# EAGLE design SonarBoardV3 (EAGLE 9.5.1)
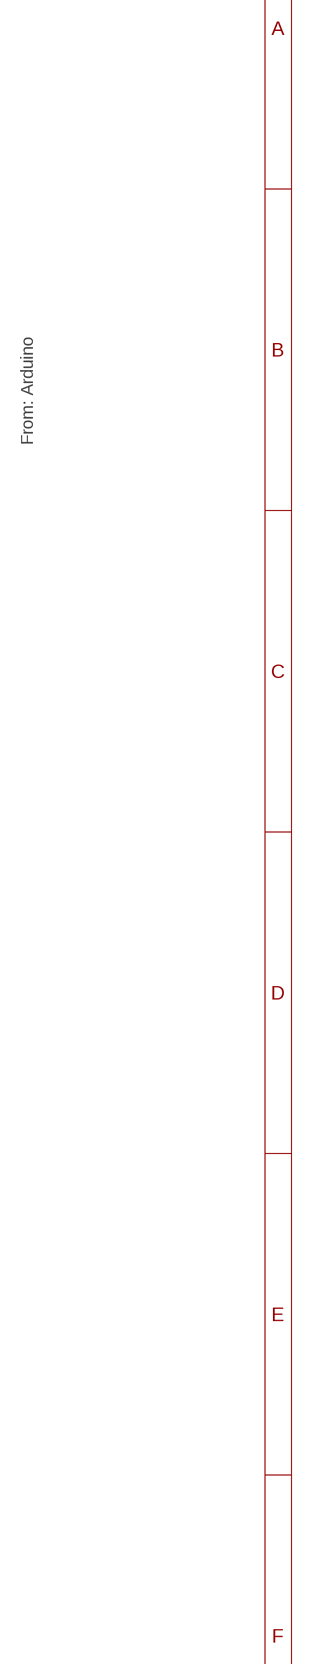
[diagram p0: schematic, sheet 1, part 1 of 2]
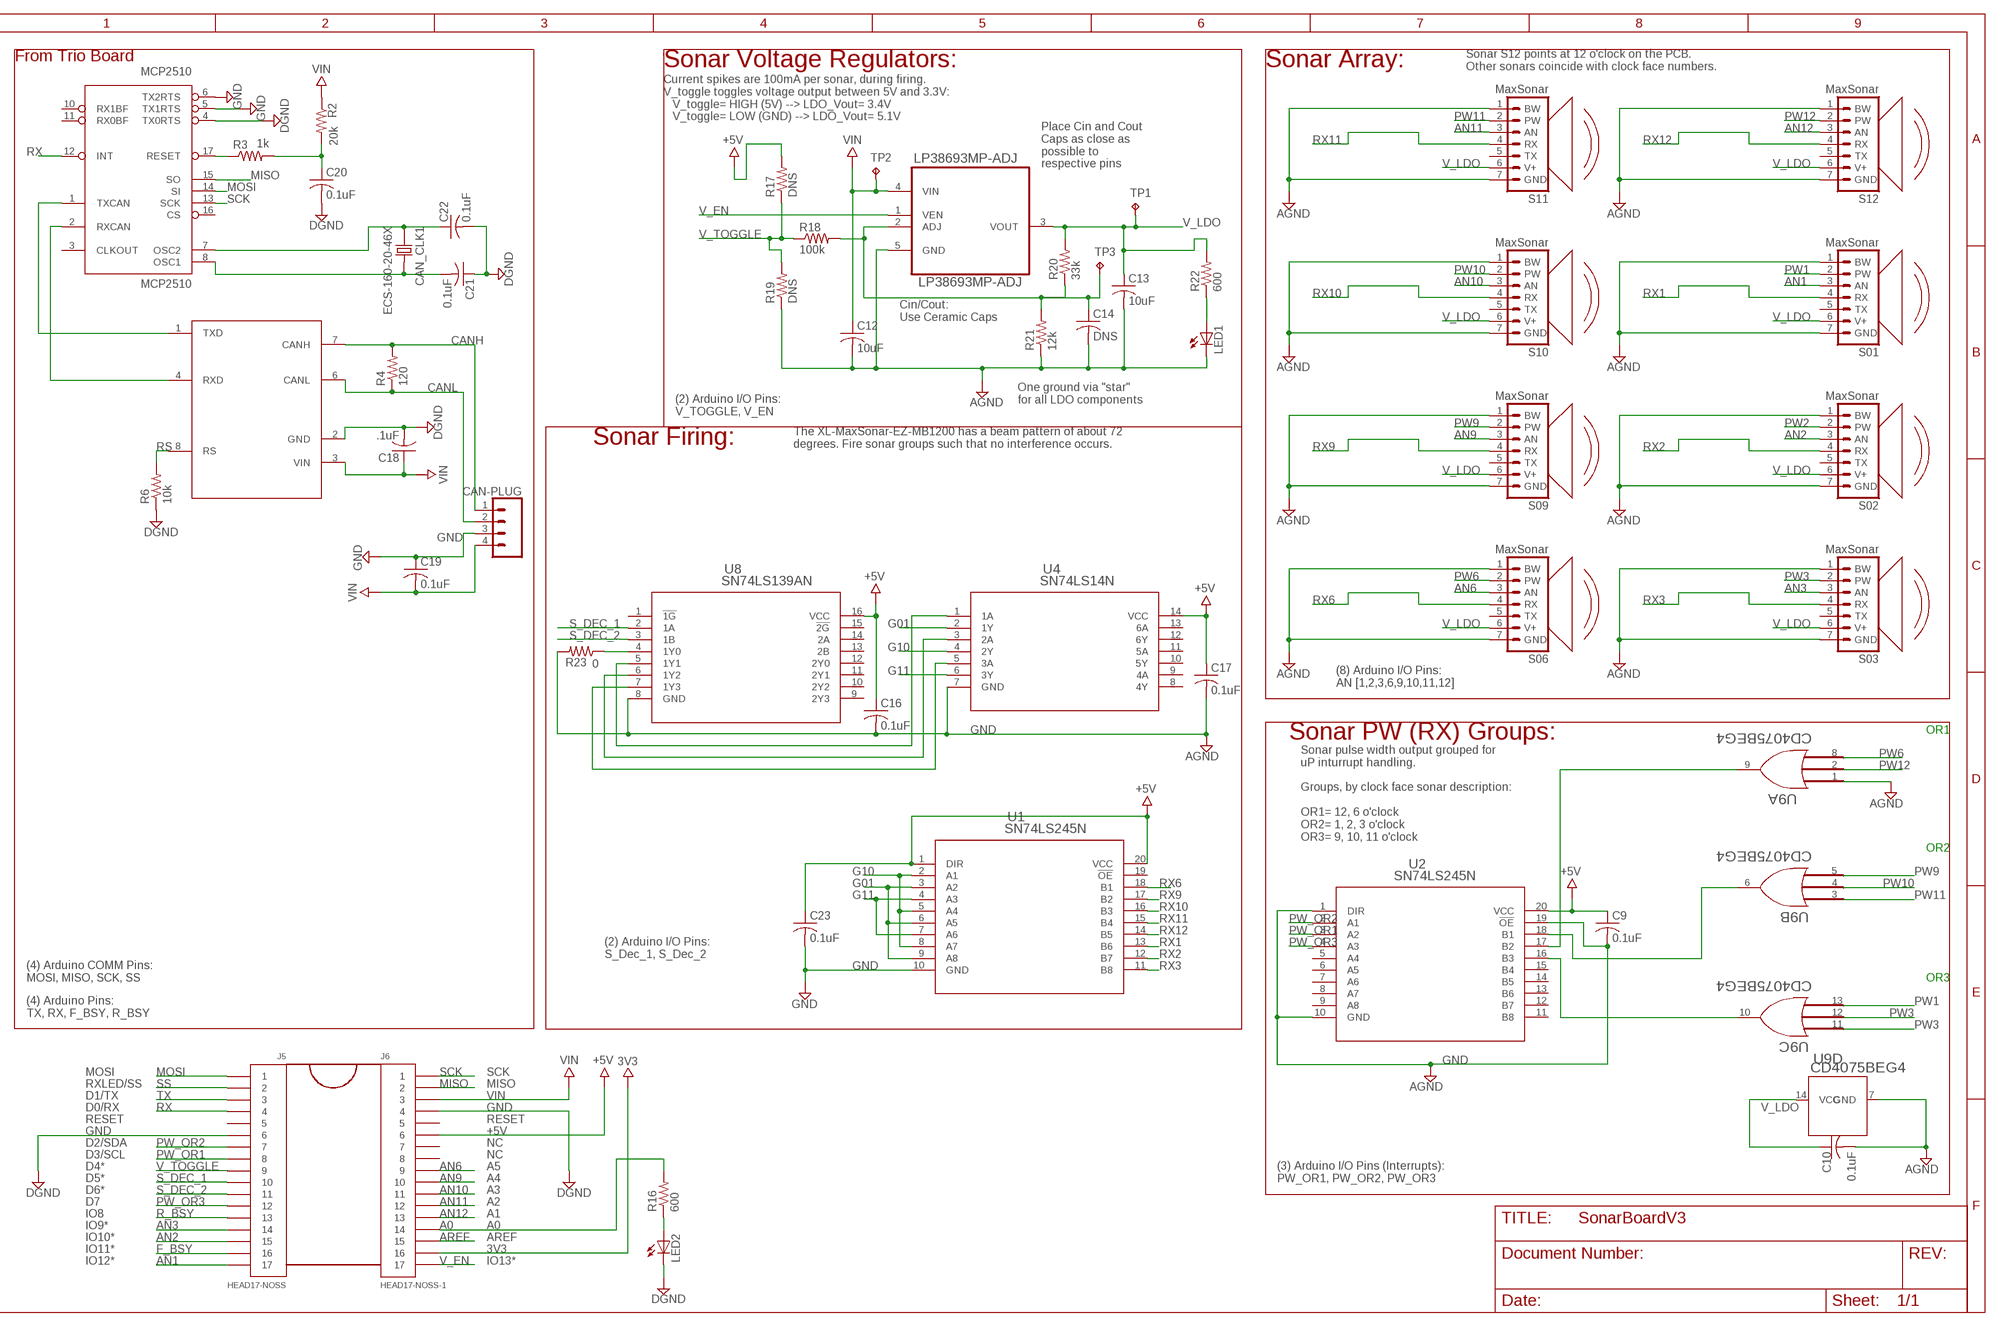
[diagram p1: schematic, sheet 1, part 2 of 2]

## Parts
C9  0.1uF  C-US025-024X044  [C025-024X044]
C10  0.1uF  C-US025-024X044  [C025-024X044]
C12  10uF  C-US025-024X044  [C025-024X044]
C13  10uF  C-US025-024X044  [C025-024X044]
C14  DNS  C-US025-024X044  [C025-024X044]
C16  0.1uF  C-US025-024X044  [C025-024X044]
C17  0.1uF  C-US025-024X044  [C025-024X044]
C18  .1uF  C-US025-024X044  [C025-024X044]
C19  0.1uF  C-US025-024X044  [C025-024X044]
C20  0.1uF  C-US025-024X044  [C025-024X044]
C21  0.1uF  C-US025-024X044  [C025-024X044]
C22  0.1uF  C-US025-024X044  [C025-024X044]
C23  0.1uF  C-US025-024X044  [C025-024X044]
CAN_CLK1  ECS-160-20-46X  [XTAL_ECS-160-20-46X]
J2  CAN-PLUG  CONN_04SCREW  [SCREWTERMINAL-3.5MM-4]
J5  HEAD17-NOSS  [HEAD17-NOSS]
J6  HEAD17-NOSS-1  [HEAD17-NOSS-1]
LED1  LED3MM  [LED3MM]
LED2  LED3MM  [LED3MM]
LP38693MP-ADJ  LP38693MP-ADJ  [SOT150P696X180-5N]
MCP2510  MCP2510  MCP2510P  [DIL18]
MCP2551  MCP2551  MCP2551MCP2551  [DIL08]
R2  20k  R-US_0207/9  [0207/9]
R3  1k  R-US_0207/9  [0207/9]
R4  120  R-US_0207/9  [0207/9]
R6  10k  R-US_0207/9  [0207/9]
R16  600  R-US_0207/9  [0207/9]
R17  DNS  R-US_0207/9  [0207/9]
R18  100k  R-US_0207/9  [0207/9]
R19  DNS  R-US_0207/9  [0207/9]
R20  33k  R-US_0207/9  [0207/9]
R21  12k  R-US_0207/9  [0207/9]
R22  600  R-US_0207/9  [0207/9]
R23  0  R-US_0207/9  [0207/9]
S01  MaxSonar  XL-MAXSONAR-EDGE_MOUNT  [XL-MAXSONAR-PACKAGE]
S02  MaxSonar  XL-MAXSONAR-EDGE_MOUNT  [XL-MAXSONAR-PACKAGE]
S03  MaxSonar  XL-MAXSONAR-EDGE_MOUNT  [XL-MAXSONAR-PACKAGE]
S06  MaxSonar  XL-MAXSONAR-EDGE_MOUNT  [XL-MAXSONAR-PACKAGE]
S09  MaxSonar  XL-MAXSONAR-EDGE_MOUNT  [XL-MAXSONAR-PACKAGE]
S10  MaxSonar  XL-MAXSONAR-EDGE_MOUNT  [XL-MAXSONAR-PACKAGE]
S11  MaxSonar  XL-MAXSONAR-EDGE_MOUNT  [XL-MAXSONAR-PACKAGE]
S12  MaxSonar  XL-MAXSONAR-EDGE_MOUNT  [XL-MAXSONAR-PACKAGE]
TP1  TPPAD1-17  [P1-17]
TP2  TPPAD1-17  [P1-17]
TP3  TPPAD1-17  [P1-17]
U1  SN74LS245N  [N20]
U2  SN74LS245N  [N20]
U4  SN74LS14N  [N14]
U8  SN74LS139AN  [N16]
U9  CD4075BEG4  [N14]

## Nets
3V3: J6.16
+5V: C9.1 C16.1 C17.1 C23.1 J6.6 R17.2 U1.1(DIR) U1.20(VCC) U2.20(VCC) U4.14(VCC) U8.16(VCC)
A0: J6.14 R16.2
AN1: J5.17 S01.3(AN)
AN2: J5.15 S02.3(AN)
AN3: J5.14 S03.3(AN)
AN6: J6.9 S06.3(AN)
AN9: J6.10 S09.3(AN)
AN10: J6.11 S10.3(AN)
AN11: J6.12 S11.3(AN)
AN12: J6.13 S12.3(AN)
AREF: J6.15
CANH: J2.1 MCP2551.7(CANH) R4.2
CANL: J2.2 MCP2551.6(CANL) R4.1
F_BSY: J5.16
G01: U1.3(A2) U1.6(A5) U1.9(A8) U4.2(1Y)
G10: U1.2(A1) U1.5(A4) U1.8(A7) U4.4(2Y)
G11: U1.4(A3) U1.7(A6) U4.6(3Y)
GND: C9.2 C10.2 C12.2 C13.2 C14.2 C16.2 C17.2 C18.2 C19.1 C20.2 C21.1 C22.2 C23.2 J2.3 J5.6 J6.4 LED1.K(C) LED2.K(C) LP38693MP-ADJ.5(GND) MCP2510.4(TX0RTS) MCP2510.5(TX1RTS) MCP2510.6(TX2RTS) MCP2551.2(GND) R6.1 R19.1 R21.1 R23.2 S01.1(BW) S01.7(GND) S02.1(BW) S02.7(GND) S03.1(BW) S03.7(GND) S06.1(BW) S06.7(GND) S09.1(BW) S09.7(GND) S10.1(BW) S10.7(GND) S11.1(BW) S11.7(GND) S12.1(BW) S12.7(GND) U1.10(GND) U2.1(DIR) U2.10(GND) U2.19(!OE) U4.7(GND) U8.8(GND) U9.7(D:GND) ; supply symbol labelled AGND, DGND
MISO: J6.2 MCP2510.15(SO)
MOSI: J5.1 MCP2510.14(SI)
N$1: U4.5(3A) U8.7(1Y3)
N$2: LED2.A R16.1
N$3: U2.16(B3) U9.10(C:J)
N$4: C21.2 CAN_CLK1.2 MCP2510.8(OSC1)
N$5: U4.3(2A) U8.6(1Y2)
N$14: LED1.A R22.1
N$21: U4.1(1A) U8.5(1Y1)
N$22: C22.1 CAN_CLK1.1 MCP2510.7(OSC2)
N$24: MCP2510.2(RXCAN) MCP2551.4(RXD)
N$25: MCP2510.1(TXCAN) MCP2551.1(TXD)
N$26: MCP2510.17(RESET) R3.1
N$27: C20.1 R2.2 R3.2
N$30: R23.1 U8.4(1Y0)
N$43: U2.17(B2) U9.9(A:J)
N$44: U2.18(B1) U9.6(B:J)
PW1: S01.2(PW)
PW2: S02.2(PW)
PW3: S03.2(PW)
PW6: S06.2(PW) ; supply symbol labelled AGND
PW9: S09.2(PW)
PW10: S10.2(PW)
PW11: S11.2(PW)
PW12: S12.2(PW)
PW_OR1: J5.8 U2.3(A2)
PW_OR2: J5.7 U2.2(A1)
PW_OR3: J5.12 U2.4(A3)
R_BSY: J5.13
RS: MCP2551.8(RS) R6.2
RX: J5.4 MCP2510.12(INT)
RX1: S01.4(RX) U1.13(B6)
RX2: S02.4(RX) U1.12(B7)
RX3: S03.4(RX) U1.11(B8)
RX6: S06.4(RX) U1.18(B1)
RX9: S09.4(RX) U1.17(B2)
RX10: S10.4(RX) U1.16(B3)
RX11: S11.4(RX) U1.15(B4)
RX12: S12.4(RX) U1.14(B5)
S_DEC_1: J5.10 U8.2(1A)
S_DEC_2: J5.11 U8.3(1B)
SCK: J6.1 MCP2510.13(SCK)
SS: J5.2
TX: J5.3
V_ADJ: C14.1 LP38693MP-ADJ.2(ADJ) R18.2 R20.1 R21.2 TP3.TP
V_EN: J6.17 LP38693MP-ADJ.1(VEN)
V_LDO: C10.1 C13.1 LP38693MP-ADJ.3(VOUT) R20.2 R22.2 S01.6(V+) S02.6(V+) S03.6(V+) S06.6(V+) S09.6(V+) S10.6(V+) S11.6(V+) S12.6(V+) TP1.TP U9.14(D:VCC)
V_TOGGLE: J5.9 R17.1 R18.1 R19.2
VIN: C12.1 C18.1 C19.2 J2.4 J6.3 LP38693MP-ADJ.4(VIN) MCP2551.3(VIN) R2.1 TP2.TP
Unconnected: J5.5 J6.5 J6.7 J6.8 MCP2510.3(CLKOUT) MCP2510.9(VSS) MCP2510.10(RX1BF) MCP2510.11(RX0BF) MCP2510.16(CS) MCP2510.18(VDD) S01.5(TX) S02.5(TX) S03.5(TX) S06.5(TX) S09.5(TX) S10.5(TX) S11.5(TX) S12.5(TX) U1.19(!OE) U2.5(A4) U2.6(A5) U2.7(A6) U2.8(A7) U2.9(A8) U2.11(B8) U2.12(B7) U2.13(B6) U2.14(B5) U2.15(B4) U4.8(4Y) U4.9(4A) U4.10(5Y) U4.11(5A) U4.12(6Y) U4.13(6A) U8.1(!1G) U8.9(2Y3) U8.10(2Y2) U8.11(2Y1) U8.12(2Y0) U8.13(2B) U8.14(2A) U8.15(!2G) U9.1(A:A) U9.2(A:B) U9.3(B:A) U9.4(B:B) U9.5(B:C) U9.8(A:C) U9.11(C:A) U9.12(C:B) U9.13(C:C)

## Notes on the sheet
- From Trio Board | Sonar Voltage Regulators: | Sonar Array:
- Sonar S12 points at 12 o'clock on the PCB.
  Other sonars coincide with clock face numbers.
- Current spikes are 100mA per sonar, during firing.
  V_toggle toggles voltage output between 5V and 3.3V:
     V_toggle= HIGH (5V) --> LDO_Vout= 3.4V
     V_toggle= LOW (GND) --> LDO_Vout= 5.1V
- Place Cin and Cout 
  Caps as close as 
  possible to 
  respective pins
- Cin/Cout:
  Use Ceramic Caps
- One ground via "star"
  for all LDO components
- From: Arduino
- (2) Arduino I/O Pins:
  V_TOGGLE, V_EN
- Sonar Firing:
- The XL-MaxSonar-EZ-MB1200 has a beam pattern of about 72
  degrees. Fire sonar groups such that no interference occurs.
- (8) Arduino I/O Pins: 
  AN [1,2,3,6,9,10,11,12]
- Sonar PW (RX) Groups:
- OR1
- Sonar pulse width output grouped for 
  uP inturrupt handling.  
  
  Groups, by clock face sonar description:
  
  OR1= 12, 6 o'clock
  OR2= 1, 2, 3 o'clock
  OR3= 9, 10, 11 o'clock
- OR2
- (2) Arduino I/O Pins: 
  S_Dec_1, S_Dec_2
- (4) Arduino COMM Pins:
  MOSI, MISO, SCK, SS
- OR3
- (4) Arduino Pins: 
  TX, RX, F_BSY, R_BSY
- MOSI | SCK
- RXLED/SS | MISO
- D1/TX | VIN
- D0/RX | GND
- RESET | RESET
- GND | +5V
- D2/SDA | NC
- D3/SCL | NC
- D4* | A5
- D5* | A4
- (3) Arduino I/O Pins (Interrupts): 
  PW_OR1, PW_OR2, PW_OR3
- D6* | A3
- D7 | A2
- IO8 | A1
- IO9* | A0
- IO10* | AREF
- IO11* | 3V3
- IO12* | IO13*

## Library data of the parts
C9 C10 C12-C14 C16 C17 C23 = adafruit:C-US: CAPACITOR, American symbol
C18-C22 = rcl:C-US: CAPACITOR, American symbol; SPICEPREFIX: C
CAN_CLK1 = ECS-160-20-46X:ECS-160-20-46X: QUARTZ CRYSTAL T/H; DESCRIPTION: Crystal 16MHz ±30ppm _Tol_ ±50ppm _Stability_ 20pF FUND 50Ohm; DIGI-KEY_PART_NUMBER: XC1759-ND; DIGI-KEY_PURCHASE_URL: https://www.digikey.com/product-detail/en/ecs-inc/ECS-160-20-46X/XC1759-ND/2676589?utm_source=snapeda&utm_medium=aggregator&utm_campaign=symbol; MF: ECS Inc.; MP: ECS-160-20-46X; PACKAGE: HC46/X ECS International
J2 = SparkFun-Connectors:CONN_04: Multi connection point. Often used as Generic Header-pin footprint for 0.1 inch spaced/style header connections On any of the 0.1 inch spaced packages, you can populate with these: Break Away Headers - Straight <https://www.sparkfun.com/products/116> (PRT-00116) Break Away Male Headers - Right Angle <https://www.sparkfun.com/products/553> (PRT-00553) Female Headers <https://www.sparkfun.com/products/115> (PRT-00115) Break Away Headers - Machine Pin <https://www.sparkfun.com/products/117> (PRT-00117) Break Away Female Headers - Swiss Machine Pin <https://www.sparkfun.com/products/743> (PRT-00743) For SCREWTERMINALS and SPRING TERMINALS visit here: Screw Terimnals on SparkFun.com <https://www.sparkfun.com/search/results?term=Screw+Terminals> (5mm/3.5mm/2.54mm spacing) This device is also useful as a general connection point to wire up your design to another part of your project. Our various solder wires solder well into these plated through hole pads. Hook-Up Wire - Assortment (Stranded, 22 AWG) <https://www.sparkfun.com/products/11375> (PRT-11375) Hook-Up Wire - Assortment (Solid Core, 22 AWG) <https://www.sparkfun.com/products/11367> (PRT-11367) View the entire wire category on our website here <https://www.sparkfun.com/categories/141> Special notes: Molex polarized connector foot print use with SKU : PRT-08231 with associated crimp pins and housings. 1MM SMD Version SKU: PRT-10208; PROD_ID: CONN-14485
J5 = SmartPrj:HEAD17-NOSS
J6 = SmartPrj:HEAD17-NOSS-1
LED1 LED2 = adafruit:LED: LED OSRAM: - CHIPLED LG R971, LG N971, LY N971, LG Q971, LY Q971, LO R971, LY R971 LH N974, LH R974 LS Q976, LO Q976, LY Q976 LO Q996 - Hyper CHIPLED LW Q18S LB Q993, LB Q99A, LB R99A - SideLED LS A670, LO A670, LY A670, LG A670, LP A670 LB A673, LV A673, LT A673, LW A673 LH A674 LY A675 LS A676, LA A676, LO A676, LY A676, LW A676 LS A679, LY A679, LG A679 - Hyper Micro SIDELED® LS Y876, LA Y876, LO Y876, LY Y876 LT Y87S - SmartLED LW L88C, LW L88S LB L89C, LB L89S, LG L890 LS L89K, LO L89K, LY L89K LS L896, LA L896, LO L896, LY L896 - TOPLED LS T670, LO T670, LY T670, LG T670, LP T670 LSG T670, LSP T670, LSY T670, LOP T670, LYG T670 LG T671, LOG T671, LSG T671 LB T673, LV T673, LT T673, LW T673 LH T674 LS T676, LA T676, LO T676, LY T676, LB T676, LH T676, LSB T676, LW T676 LB T67C, LV T67C, LT T67C, LS T67K, LO T67K, LY T67K, LW E67C LS E67B, LA E67B, LO E67B, LY E67B, LB E67C, LV E67C, LT E67C LW T67C LS T679, LY T679, LG T679 LS T770, LO T770, LY T770, LG T770, LP T770 LB T773, LV T773, LT T773, LW T773 LH T774 LS E675, LA E675, LY E675, LS T675 LS T776, LA T776, LO T776, LY T776, LB T776 LHGB T686 LT T68C, LB T68C - Hyper Mini TOPLED® LB M676 - Mini TOPLED Santana® LG M470 LS M47K, LO M47K, LY M47K Source: http://www.osram.convergy.de/
LP38693MP-ADJ = ElcanoProject:LP38693MP-ADJ: IC, ADJ LDO REG, 1.25V TO 9V; MPN: LP38693MP-ADJ; OC_FARNELL: 1685718; OC_NEWARK: 41K7493; PACKAGE: SOT-223-5; SUPPLIER: NationalSemiconductor
MCP2510 = microchip_can:MCP2510
MCP2551 = MCP2551:MCP2551
R2-R4 R6 R16-R23 = adafruit:R-US_: RESISTOR, American symbol
S01-S03 S06 S09 S10-S12 = ElcanoProject:XL-MAXSONAR
TP1-TP3 = testpad:TP: Test pad
U1 U2 = SN74LS245:SN74LS245N; MANUFACTURER_PART_NUMBER: SN74LS245N; VENDOR: Texas Instruments
U4 = SN74LS14:SN74LS14N; MANUFACTURER_PART_NUMBER: SN74LS14N; VENDOR: Texas Instruments
U8 = SN74LS139AN:SN74LS139AN; MANUFACTURER_PART_NUMBER: SN74LS139AN; VENDOR: Texas Instruments
U9 = CD4075BE:CD4075BEG4; MANUFACTURER_PART_NUMBER: CD4075BEG4; VENDOR: Texas Instruments

## Net classes
0 default: width 0.254 mm, drill 0.508 mm, clearance 0.203 mm

## Board
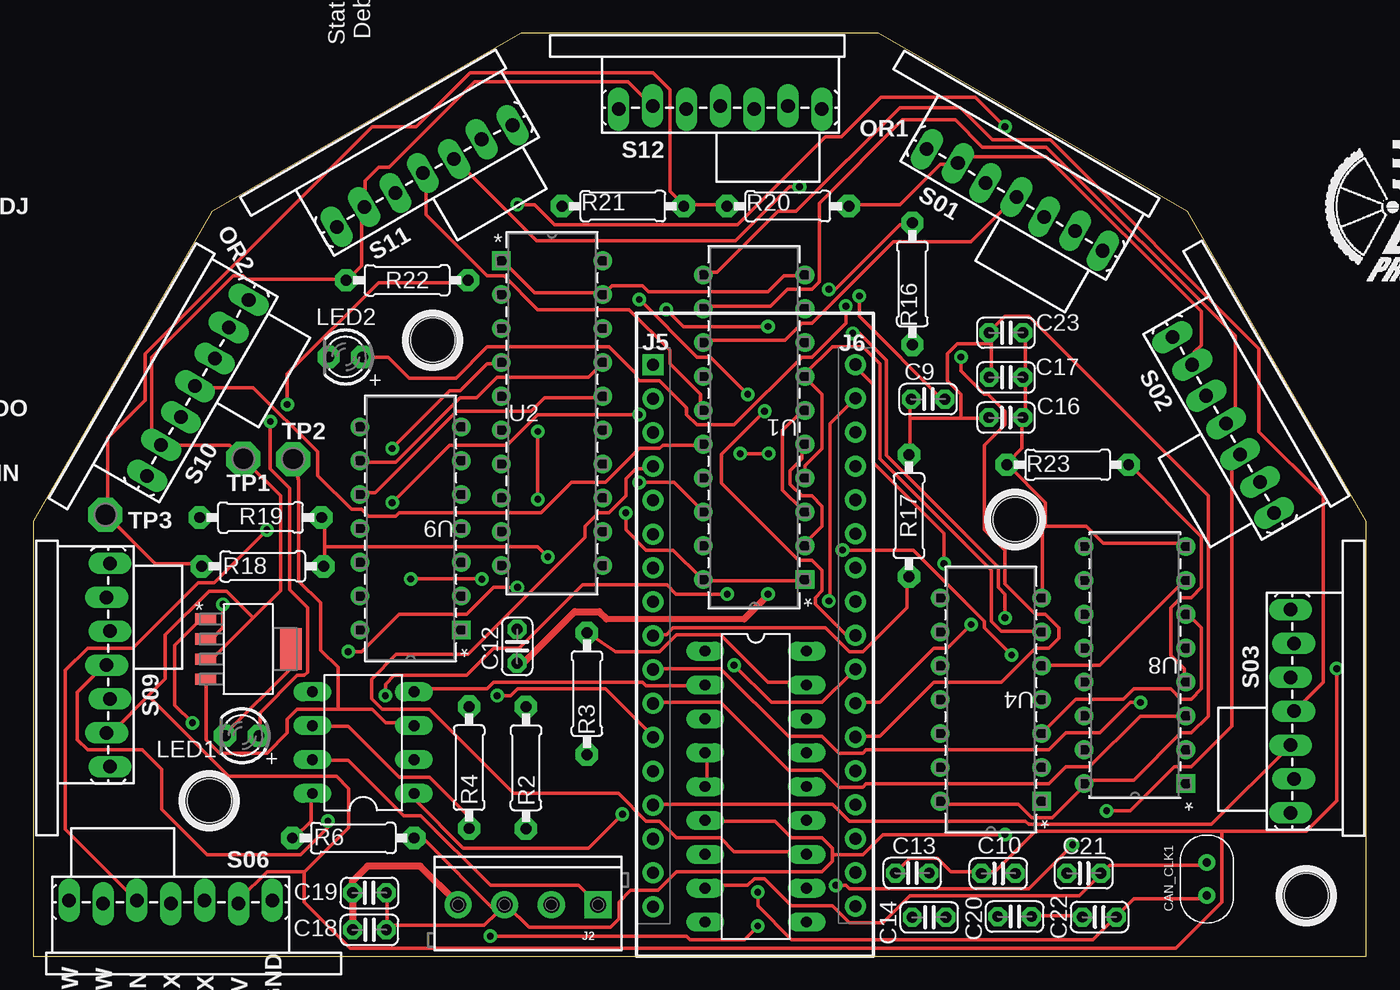
[diagram p2: board, top side]
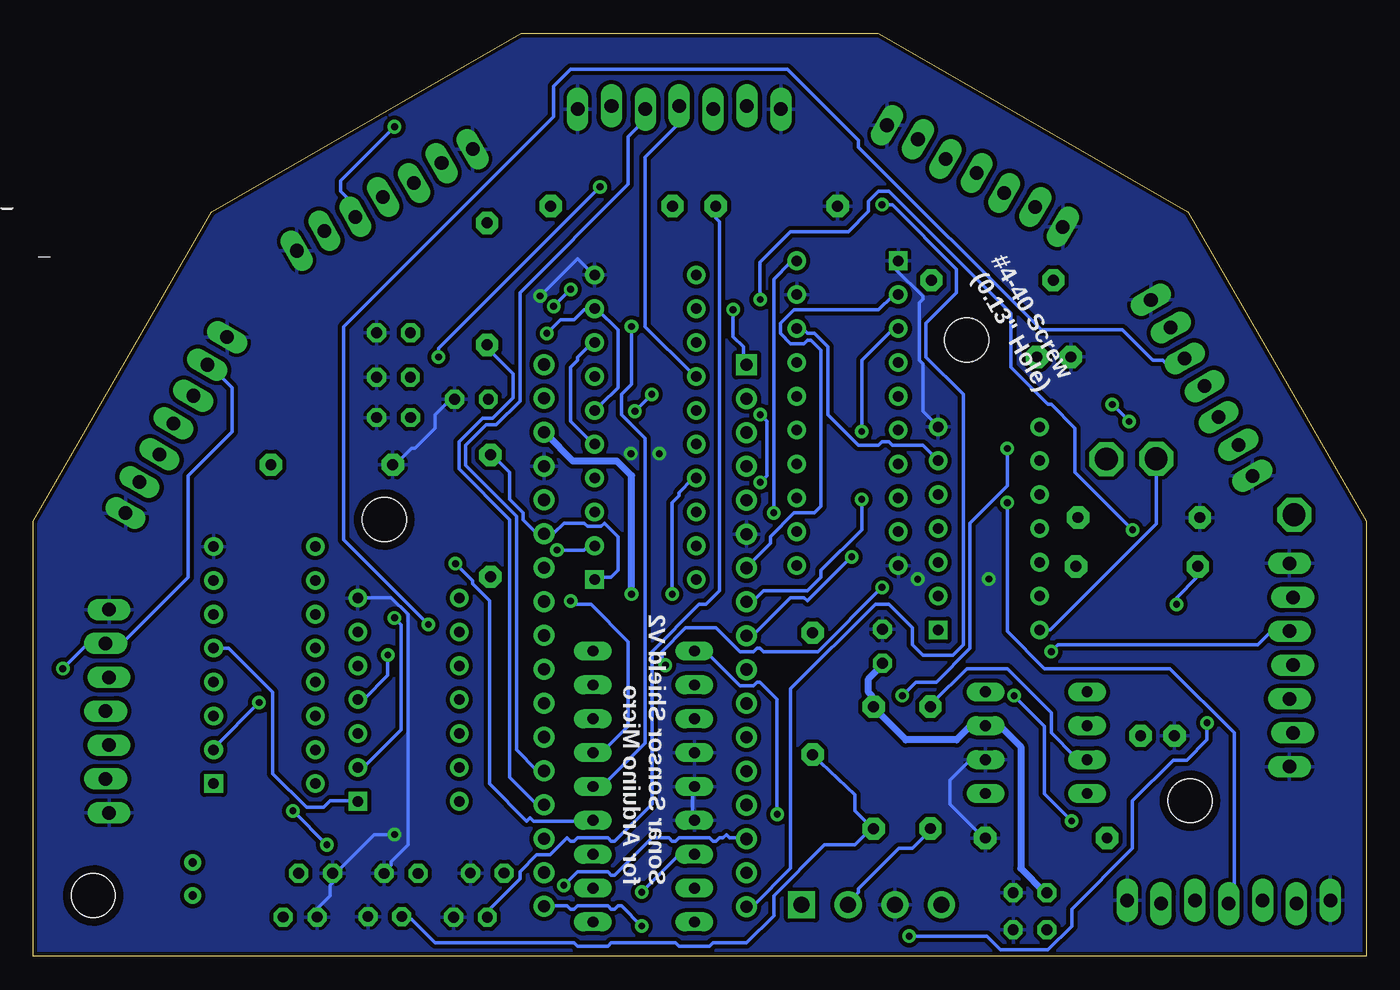
[diagram p3: board, bottom side, seen from below]

Size 100 x 69.24 mm. Coordinates in mm from the lower left corner, seen from the top.
Outline: 0,0 100,0 100,32.63 86.6,55.84 63.4,69.24 36.6,69.24 13.4,55.84 0,32.63 0,0
Copper layers (1*16): Top 0.035mm / dielectric 1.5mm / Bottom 0.035mm
Design rules "SparkFun *": minimum track width 8mil, minimum drill 20mil, track to track 10mil, track to pad 10mil, pad to pad 8mil, via to via 8mil, smd to smd 8mil, copper to edge 10mil, drill to drill 8mil, minimum pad ring 12mil, minimum via ring 10mil, stop-mask expansion 4mil, vias tented up to drill 25mil, thermal gap 10mil

### Footprints (pad centres in the part's own frame; a part is rotated, then mirrored left to right if it is on the bottom)
C025-024X044 = drill 0.813 pad 1.422 octagon: 1 -1.27,0; 2 1.27,0
C025-024X044' = drill 0.813 octagon: 1 -1.27,0; 2 1.27,0
XTAL_ECS-160-20-46X = drill 0.63 pad 1.03: 1 -1.25,0; 2 1.25,0
SCREWTERMINAL-3.5MM-4 = drill 1.2 pad 2.032 square: 1 0,0 | drill 1.2 pad 2.032: 2 3.5,0; 3 7,0; 4 10.5,0
HEAD17-NOSS = drill 0.914 pad 1.575 square: 1 0,0 | drill 0.914 pad 1.575: 2 2.54,0; 3 5.08,0; 4 7.62,0; 5 10.16,0; 6 12.7,0; 7 15.24,0; 8 17.78,0; 9 20.32,0; 10 22.86,0; 11 25.4,0; 12 27.94,0; 13 30.48,0; 14 33.02,0; 15 35.56,0; 16 38.1,0; 17 40.64,0
HEAD17-NOSS-1 = drill 0.914 pad 1.575: 1 0,0; 2 2.54,0; 3 5.08,0; 4 7.62,0; 5 10.16,0; 6 12.7,0; 7 15.24,0; 8 17.78,0; 9 20.32,0; 10 22.86,0; 11 25.4,0; 12 27.94,0; 13 30.48,0; 14 33.02,0; 15 35.56,0; 16 38.1,0; 17 40.64,0
LED3MM = drill 0.813 pad 1.676 octagon: A -1.27,0; K 1.27,0
SOT150P696X180-5N = smd 1.6 x 0.838: 1 -3.2,2.261; 2 -3.2,0.762; 3 -3.2,-0.762; 4 -3.2,-2.261 | smd 1.6 x 3.099: 5 3.2,0
DIL18 = drill 0.813 long: 1 -10.16,-3.81; 2 -7.62,-3.81; 3 -5.08,-3.81; 4 -2.54,-3.81; 5 0,-3.81; 6 2.54,-3.81; 7 5.08,-3.81; 8 7.62,-3.81; 9 10.16,-3.81; 10 10.16,3.81; 11 7.62,3.81; 12 5.08,3.81; 13 2.54,3.81; 14 0,3.81; 15 -2.54,3.81; 16 -5.08,3.81; 17 -7.62,3.81; 18 -10.16,3.81
DIL08 = drill 0.813 long: 1 -3.81,-3.81; 2 -1.27,-3.81; 3 1.27,-3.81; 4 3.81,-3.81; 5 3.81,3.81; 6 1.27,3.81; 7 -1.27,3.81; 8 -3.81,3.81
0207/9 = drill 0.813 pad 1.676 octagon: 1 -4.572,0; 2 4.572,0
XL-MAXSONAR-PACKAGE = drill 1.016 long: 1 -9.16,0.167; 2 -6.62,-0.087; 3 -4.08,0.167; 4 -1.54,-0.087; 5 1,0.167; 6 3.54,-0.087; 7 6.08,0.167
P1-17 = drill 1.702 pad 2.54 octagon: TP 0,0
N20 = drill 0.787 pad 1.295 square: 1 -7.62,22.86 | drill 0.787 pad 1.295: 2 -7.62,20.32; 3 -7.62,17.78; 4 -7.62,15.24; 5 -7.62,12.7; 6 -7.62,10.16; 7 -7.62,7.62; 8 -7.62,5.08; 9 -7.62,2.54; 10 -7.62,0; 11 0,0; 12 0,2.54; 13 0,5.08; 14 0,7.62; 15 0,10.16; 16 0,12.7; 17 0,15.24; 18 0,17.78; 19 0,20.32; 20 0,22.86
N14 = drill 0.787 pad 1.295 square: 1 -7.62,15.24 | drill 0.787 pad 1.295: 2 -7.62,12.7; 3 -7.62,10.16; 4 -7.62,7.62; 5 -7.62,5.08; 6 -7.62,2.54; 7 -7.62,0; 8 0,0; 9 0,2.54; 10 0,5.08; 11 0,7.62; 12 0,10.16; 13 0,12.7; 14 0,15.24
N16 = drill 0.787 pad 1.295 square: 1 -7.62,17.78 | drill 0.787 pad 1.295: 2 -7.62,15.24; 3 -7.62,12.7; 4 -7.62,10.16; 5 -7.62,7.62; 6 -7.62,5.08; 7 -7.62,2.54; 8 -7.62,0; 9 0,0; 10 0,2.54; 11 0,5.08; 12 0,7.62; 13 0,10.16; 14 0,12.7; 15 0,15.24; 16 0,17.78
STAND-OFF = hole 3.302: 0,0

### Placement (x,y rotation side)
C9  67.13,41.81 0 top
C10  72.4,6.23 0 top
C12  36.3,23.26 90 top
C13  65.94,6.26 0 top
C14  67.21,2.94 0 top
C16  72.97,40.42 0 top
C17  72.98,43.44 0 top
C18  .1uF  [C025-024X044']  25.22,2 0 top
C19  0.1uF  [C025-024X044']  25.22,4.77 180 top
C20  0.1uF  [C025-024X044']  73.62,2.99 0 top
C21  0.1uF  [C025-024X044']  78.82,6.25 0 top
C22  0.1uF  [C025-024X044']  79.98,2.96 180 top
C23  72.98,46.78 0 top
CAN_CLK1  88.04,5.81 90 top
J2  42.36,3.88 180 top
J5  46.49,44.38 270 top
J6  61.68,44.4 270 top
LED1  15.65,16.56 180 top
LED2  23.42,44.96 180 top
LP38693MP-ADJ  16.13,23.06 0 top
MCP2510  54.21,12.75 270 top
MCP2551  24.75,16.04 90 top
R2  36.96,14.16 270 top
R3  41.53,19.71 270 top
R4  32.7,14.17 90 top
R6  24.01,8.88 180 top
R16  65.95,50.45 270 top
R17  65.7,33.05 90 top
R18  17.2,29.26 180 top
R19  17.05,32.92 0 top
R20  56.61,56.28 0 top
R21  44.23,56.28 0 top
R22  28.04,50.72 180 top
R23  77.6,36.88 180 top
S01  72.39,57.66 150 top
S02  88.65,41.27 120 top
S03  94.49,19.94 90 top
S06  11.85,4.05 0 top
S09  5.59,20.32 270 top
S10  11.43,41.4 240 top
S11  27.94,57.91 210 top
S12  50,63.71 180 top
TP1  15.76,37.34 0 top
TP2  19.5,37.3 270 top
TP3  5.41,33.13 0 top
U1  50.27,51.12 180 top
U2  42.72,29.32 0 top
U4  68.03,26.88 180 top
U8  78.85,30.74 180 top
U9  24.49,39.73 180 top
U$15  [STAND-OFF]  29.97,46.23 0 top
U$16  [STAND-OFF]  73.66,32.77 0 top
U$17  [STAND-OFF]  95.5,4.57 0 top
U$18  [STAND-OFF]  13.21,11.68 0 top

### Tracks (layer width: path | path; a pad name or v marks a point on that pad's centre or on a via)
+5V  (via drill 0.51)
  Top 0.254: U1.1 57.66,28.19 50.29,28.19 U1.20 50.04,28.45 48.01,30.48 45.97,30.48 44.45,32 v44.45,33.27 | U4.14 68.07,11.43 73.91,11.43 74.93,10.41 76.45,10.41 78.99,12.95 U8.16 78.99,13.21 82.55,13.21 86.11,16.76 86.87,16.76 88.14,18.03 88.14,34.54 74.68,48.01 72.9,48.01 71.88,46.99 C23.1 71.88,46.74 71.88,45.97 | 71.88,45.97 71.88,43.69 C17.1 | 65.79,40.39 65.79,37.85 R17.2 | 65.79,40.39 65.79,41.66 C9.1 | 65.79,40.39 69.6,40.39 | 69.6,40.39 71.63,40.39 C16.1 | 71.88,45.97 69.34,45.97 68.58,45.21 68.58,43.18 69.6,42.16 69.6,40.39
  Bottom 0.254: v44.45,33.27 44.45,50.8 43.18,52.07 42.93,52.07 U2.20 | R17.2 65.53,37.59 64.26,36.32 64.26,34.29 63.25,33.27 63.25,32.77 62.23,31.75 61.72,31.75 J6.6 61.47,31.75 60.96,31.75 60.2,32.51 58.67,32.51 58.42,32.26 57.4,32.26 57.15,32.51 56.13,31.5 56.13,28.96 56.64,28.45 57.66,28.45 U1.1
A0
  Bottom 0.254: J6.14 61.72,11.43 62.23,11.43 64.26,13.46 64.26,32.77 68.07,36.58 68.07,38.61 66.29,40.39 65.53,40.39 64.01,41.91 64.01,43.69 66.04,45.72 R16.2
AN1  (via drill 0.51)
  Top 0.254: v36.32,56.39 37.59,56.39 39.12,54.86 52.83,54.86 59.44,61.47 60.63,61.47 63.59,64.43 70.7,64.43 v72.9,62.23
  Bottom 0.254: v36.32,56.39 35.56,56.39 30.73,51.56 30.73,49.78 33.02,47.5 33.02,44.96 30.23,42.16 30.23,23.37 30.99,22.61 33.27,22.61 34.04,23.37 34.04,24.64 35.81,26.42 36.83,26.42 43.18,20.07 43.18,6.6 45.97,3.81 46.48,3.81 J5.17 | v72.9,62.23 76.96,58.17 76.96,57.4 75.95,56.39 75.95,55.63 S01.3
AN2  (via drill 0.51)
  Top 0.254: v60.2,5.33 60.96,5.33 61.21,5.08 74.68,5.08 v77.98,8.38 | v80.52,10.92 82.3,10.92 85.6,14.22 86.87,14.22 89.92,17.27 89.92,37.08 90.42,37.59 S02.3
  Bottom 0.254: v60.2,5.33 59.18,6.35 56.9,6.35 56.64,6.1 56.39,6.1 53.59,8.89 52.32,8.89 52.07,8.64 51.82,8.64 51.56,8.89 49.28,8.89 49.02,8.64 48.77,8.64 48.51,8.89 48.26,8.89 48.01,9.14 47.75,8.89 46.74,8.89 J5.15 | v80.52,10.92 v77.98,8.38
AN3
  Top 0.254: J5.14 46.74,11.43 59.94,11.43 61.21,10.16 74.42,10.16 74.68,9.91 88.39,9.91 94.23,15.75 S03.3
AN6  (via drill 0.51)
  Top 0.254: v54.86,40.89 51.62,37.66 51.62,35.5 57.4,29.72 58.42,29.72 59.18,28.96 59.18,27.43 58.67,26.92 58.67,26.42 60.96,24.13 61.47,24.13 J6.9 | v53.59,42.16 50.8,44.96 49.78,44.96 v45.47,49.28 | v17.53,32 13.55,28.03 12.36,28.03 7.44,23.11 4.06,23.11 2.4,21.45 2.4,9.54 7.62,4.32 S06.3
  Bottom 0.254: v53.59,42.16 v54.86,40.89 | v45.47,49.28 45.47,52.07 43.18,54.36 38.86,54.36 37.34,55.88 37.34,56.64 36.58,57.4 35.81,57.4 26.67,48.26 26.67,44.2 23.88,41.4 23.62,41.4 21.84,39.62 21.84,36.32 v17.53,32
AN9  (via drill 0.51)
  Top 0.254: v52.58,21.84 55.37,19.05 59.18,19.05 61.47,21.34 J6.10 | v36.32,27.69 34.54,27.69 32.51,25.65 27.43,25.65 24.64,22.86 v23.62,22.86
  Bottom 0.254: v52.58,21.84 52.83,22.1 52.83,22.86 51.05,24.64 48.77,24.64 46.99,22.86 45.97,22.86 45.72,23.11 45.47,23.11 45.21,22.86 41.15,22.86 v36.32,27.69 | v23.62,22.86 23.11,23.37 8.13,23.37 7.11,24.38 5.84,24.38 S09.3
AN10  (via drill 0.51)
  Top 0.254: v70.36,24.89 68.58,23.11 67.56,23.11 63.5,19.05 61.72,19.05 J6.11
  Bottom 0.254: v70.36,24.89 76.71,31.24 76.71,47.24 60.96,62.99 60.96,65.28 59.69,66.55 43.43,66.55 38.1,61.21 38.1,60.71 24.38,46.99 18.29,46.99 16,44.7 15.24,44.7 14.99,44.45 13.97,44.45 13.72,44.7 S10.3
AN11  (via drill 0.51)
  Top 0.254: v69.6,44.96 69.6,43.94 71.37,42.16 71.63,42.16 72.9,40.89 72.9,39.88 71.37,38.35 71.37,32 72.9,30.48 72.9,27.94 75.18,25.65 75.95,25.65 76.96,24.64 76.96,23.88 76.2,23.11 75.18,23.11 72.64,20.57 67.56,20.57 63.5,16.51 61.72,16.51 J6.12 | v57.48,57.73 56.73,57.73 52.67,53.67 37.77,53.67 31.75,59.69 S11.3
  Bottom 0.254: v69.6,44.96 69.6,45.62 v57.48,57.73
AN12
  Bottom 0.254: J6.13 61.72,13.97 62.23,13.97 63.75,15.49 63.75,33.02 67.56,36.83 67.56,38.35 66.04,39.88 65.28,39.88 63.5,41.66 63.5,49.78 55.37,57.91 55.37,61.47 54.1,62.74 54.1,63.5 S12.3
CANH
  Top 0.254: MCP2551.7 21.08,14.73 23.62,14.73 27.8,10.56 29.07,10.56 34.29,5.33 40.89,5.33 42.16,4.06 J2.1
  Bottom 0.254: R4.2 32.51,18.8 32.51,19.05 29.97,21.59 26.92,21.59 23.62,18.29 23.62,16.76 21.84,14.99 21.08,14.99 MCP2551.7
CANL
  Top 0.254: MCP2551.6 21.08,17.27 23.62,17.27 27.43,13.46 29.72,13.46 32.51,10.67 32.51,9.65 R4.1
  Bottom 0.254: J2.2 38.86,4.06 38.1,4.83 38.1,5.08 35.05,8.13 34.04,8.13 32.77,9.4 R4.1
G01  (via drill 0.51)
  Top 0.254: U1.3 57.66,33.53 56.22,34.97 56.22,39.45 57.66,40.89 U1.6 | v72.9,25.4 72.9,27.18 72.39,27.69 72.39,29.21 64.01,37.59 64.01,44.7 61.98,46.74 v61.47,46.74
  Bottom 0.254: U1.6 57.91,41.15 57.66,41.4 57.4,41.4 56.13,42.67 56.13,46.99 57.66,48.51 U1.9 57.91,48.51 58.67,48.51 59.44,47.75 60.45,47.75 v61.47,46.74 | v72.9,25.4 72.39,24.89 72.39,17.02 75.18,14.22 75.44,14.22 U4.2
G10  (via drill 0.51)
  Top 0.254: v73.41,22.61 71.37,24.64 71.37,25.15 66.04,30.48 v60.71,30.48 | U1.5 57.66,38.35 57.66,37.34 56.77,36.45 56.77,35.44 57.66,34.54 58.42,34.54 59.18,33.78 59.18,32.26 57.91,30.99 U1.2
  Bottom 0.254: v73.41,22.61 73.41,21.08 75.18,19.3 75.44,19.3 U4.4 | v60.71,30.48 58.67,30.48 58.42,30.73 57.91,30.73 U1.2 | U1.8 57.91,45.97 58.17,45.97 59.18,44.96 59.18,44.7 59.69,44.2 59.69,40.13 57.91,38.35 U1.5
G11
  Top 0.254: U4.6 75.44,24.38 72.64,24.38 71.88,25.15 71.88,28.96 63.5,37.34 63.5,44.45 62.23,45.72 59.94,45.72 57.91,43.69 U1.7 57.91,43.43 59.18,42.16 59.18,38.09 57.91,36.82 57.91,36.07 U1.4
GND  (via drill 0.51)
  Top 0.254: LP38693MP-ADJ.5 19.3,22.86 19.3,21.59 14.48,16.76 LED1.K | v28.32,28.32 33.64,28.32 v33.66,28.3 | C20.2 74.93,3.05 78.49,3.05 C22.2 | MCP2510.4 50.55,15.24 50.55,12.95 MCP2510.5 | 26.54,2.08 26.54,4.71 C19.1 | 26.67,2.29 26.67,2.33 33.83,2.33 34.79,3.3 | 26.67,2.29 26.67,2.03 C18.2 26.54,2.08 | 34.8,3.3 35.31,3.81 J2.3 | 34.8,3.3 34.79,3.3 | 26.67,2.29 26.54,2.08 | 59.94,7.62 59.94,7.14 59.15,6.35 48.26,6.35 46.87,4.96 44.82,4.96 43.94,4.08 43.94,2.82 43.3,2.18 37.19,2.18 35.56,3.81 J2.3 | 59.94,7.62 59.94,8.13 59.18,8.89 56.9,8.89 55.63,10.16 50.55,10.16 MCP2510.6 | v72.9,9.14 63.75,9.14 62.23,7.62 59.94,7.62 | R6.1 28.59,8.89 29.19,8.89 34.79,3.3 | 34.8,3.3 J2.3 | U2.1 35.31,52.07 37.59,49.78 42.67,49.78 U2.19 42.93,49.78 43.43,50.29 45.72,50.29 46.16,49.85 55.1,49.85 56.31,51.05 57.66,51.05 U1.10 | C23.2 74.42,46.74 74.42,43.69 C17.2 74.42,43.43 74.42,40.64 C16.2 74.17,40.39 74.17,38.1 73.15,37.08 R23.2 73.15,36.83 75.95,34.04 75.95,32.26 | 75.95,32.26 75.69,32 75.69,26.92 U4.7 | 75.95,32.26 78.99,32.26 80.26,30.99 86.36,30.99 U8.8 | v61.98,49.53 61.98,48.01 68.33,41.66 C9.2 | v53.04,37.71 v55.16,37.71
  Bottom 0.254: MCP2551.2 28.7,14.73 29.72,14.73 31.24,13.21 31.24,11.43 28.7,8.89 R6.1 | C22.2 78.74,3.05 78.74,3.56 77.72,4.57 77.72,5.33 77.47,5.59 77.47,6.1 C21.1 77.47,6.35 77.22,6.35 74.42,9.14 v72.9,9.14 | MCP2510.6 50.55,10.41 50.55,12.7 MCP2510.5 | U9.7 32.26,39.88 33.27,40.89 33.27,44.45 33.53,44.7 33.53,49.02 33.27,49.28 33.27,49.53 35.31,51.56 35.31,52.07 U2.1 | C10.2 73.66,6.35 73.15,6.86 73.15,7.11 71.88,8.38 71.88,25.65 73.15,26.92 75.44,26.92 U4.7 | C9.2 68.58,41.66 68.83,41.66 69.85,40.64 69.85,39.62 71.37,38.1 71.63,38.1 72.9,36.83 R23.2 | v61.98,49.53 59.18,52.32 58.17,51.31 57.91,51.31 U1.10
  pour Bottom (isolate 0.305): 0,0 100.08,0 100.08,32.51 86.61,55.88 63.37,69.22 36.58,69.22 13.46,55.88 0,32.64
MISO  (via drill 0.51)
  Top 0.254: v59.69,26.67 59.78,26.76 59.78,39.97 61.47,41.66 J6.2
  Bottom 0.254: v59.69,26.67 59.44,26.42 58.17,26.42 55.37,23.62 55.37,17.27 57.15,15.49 57.91,15.49 MCP2510.15
MOSI  (via drill 0.51)
  Top 0.254: v55.12,47.24 48.77,47.24 v47.5,48.51
  Bottom 0.254: v55.12,47.24 55.12,42.93 55.88,42.16 55.88,40.64 54.1,38.86 54.1,16 57.15,12.95 57.91,12.95 MCP2510.14 | v47.5,48.51 47.5,46.48 46.74,45.72 46.74,44.45 J5.1
N$1
  Top 0.254: U4.5 75.69,21.84 80.01,21.84 86.36,28.19 U8.7
N$2  (via drill 0.51)
  Top 0.254: v60.96,48.77 60.96,47.5 58.42,44.96 57.66,44.96 52.58,39.88 49.78,39.88 49.02,40.64 49.02,41.15 46.99,43.18 45.47,43.18 45.21,43.43 45.21,43.69 43.18,45.72 34.06,45.72 31.7,43.37 28.21,43.37 26.61,44.96 24.89,44.96 LED2.A | v59.69,50.04 60.2,50.04 65.02,54.86 65.79,54.86 R16.1
  Bottom 0.254: v59.69,50.04 v60.96,48.77
N$3
  Top 0.254: U9.10 24.64,34.8 25.65,34.8 31.75,40.89 37.34,40.89 38.35,41.91 42.67,41.91 U2.16
N$4
  Top 0.254: CAN_CLK1.2 87.88,6.86 80.77,6.86 80.26,6.35 C21.2 80.01,6.1 78.49,4.57 65.79,4.57 63.75,2.54 61.21,2.54 59.94,3.81 56.9,3.81 54.86,5.84 54.1,5.84 53.59,5.33 50.55,5.33 MCP2510.8
N$5
  Top 0.254: U4.3 75.69,16.76 78.23,19.3 81.79,19.3 82.55,20.07 85.34,20.07 86.11,19.3 86.87,19.3 87.63,20.07 87.63,24.64 86.61,25.65 U8.6
N$14  (via drill 0.51)
  Top 0.254: v17.78,40.13 17.78,36.58 19.23,35.13 19.23,27.51 20.57,26.16 20.57,21.34 20.32,21.08 19.81,21.08 17.02,18.29 17.02,16.76 LED1.A | v19.05,41.4 19.05,43.69 25.91,50.55 32.51,50.55 R22.1
  Bottom 0.254: v19.05,41.4 v17.78,40.13
N$21
  Bottom 0.254: U4.1 75.69,11.68 77.72,11.68 78.23,11.18 79.5,11.18 82.04,13.72 82.04,19.81 85.34,23.11 86.36,23.11 U8.5
N$22  (via drill 0.51)
  Top 0.254: CAN_CLK1.1 87.88,4.32 82.55,4.32 81.28,3.05 C22.1 81.03,2.79 79.5,1.27 56.9,1.27 54.36,3.81 v54.36,4.83
  Bottom 0.254: v54.36,4.83 51.56,7.62 50.55,7.62 MCP2510.7
N$24
  Top 0.254: MCP2551.4 28.7,20.07 34.04,20.07 34.54,20.57 45.72,20.57 45.97,20.32 50.29,20.32 MCP2510.2
N$25  (via drill 0.51)
  Top 0.254: v44.2,10.67 41.66,8.13 32.26,8.13 28.7,11.68 28.7,12.19 MCP2551.1
  Bottom 0.254: v44.2,10.67 44.2,19.3 45.47,20.57 45.72,20.57 45.97,20.32 46.99,20.32 49.53,22.86 50.29,22.86 MCP2510.1
N$26
  Top 0.254: MCP2510.17 57.91,20.57 55.12,20.57 51.56,24.13 48.26,24.13 46.99,22.86 43.69,22.86 41.57,24.29 R3.1
N$27
  Bottom 0.254: 37.08,9.65 38.35,8.38 40.64,8.38 44.45,4.57 44.45,3.05 46.48,1.02 49.02,1.02 49.28,0.76 51.56,0.76 51.82,1.02 56.64,1.02 56.9,0.76 59.18,0.76 59.44,1.02 69.85,1.02 71.63,2.79 72.14,2.79 C20.1 | 37.08,9.65 38.35,10.92 38.35,12.12 R3.2 | 37.08,9.65 R2.2
N$30
  Top 0.254: U8.4 86.36,20.83 86.36,21.59 85.34,22.61 85.34,26.16 86.11,26.92 86.87,26.92 87.63,27.69 87.63,31.5 82.3,36.83 R23.1
N$43
  Top 0.254: U9.9 24.64,37.08 27.18,37.08 32,41.91 33.27,41.91 34.8,43.43 41.66,43.43 42.67,44.45 U2.17
N$44
  Bottom 0.254: U9.6 32.26,37.34 33.27,38.35 35.56,38.35 35.81,38.61 36.32,38.61 36.58,38.35 38.1,38.35 40.39,40.64 40.39,45.72 41.4,46.74 41.91,46.74 42.16,46.99 42.67,46.99 U2.18
PW_OR1  (via drill 0.51)
  Top 0.254: v37.85,34.29 v37.85,39.37
  Bottom 0.254: v37.85,39.37 37.85,44.7 35.56,46.99 35.31,46.99 U2.3 | v37.85,34.29 37.85,32 40.89,28.96 40.89,28.45 41.91,27.43 45.21,27.43 45.97,26.67 46.48,26.67 J5.8
PW_OR2
  Bottom 0.254: U2.2 35.31,49.53 35.56,49.53 36.58,48.51 42.93,48.51 43.94,47.5 43.94,46.74 43.18,45.97 42.16,45.97 41.91,46.23 41.66,46.23 40.89,45.47 40.89,33.78 41.4,33.27 42.93,33.27 44.7,31.5 44.7,30.99 46.48,29.21 J5.7
PW_OR3  (via drill 0.51)
  Top 0.254: v26.92,38.1 31.24,42.42 32,42.42 34.04,44.45 35.05,44.45 U2.4 | v34.8,19.56 35.81,19.56 36.32,20.07 42.93,20.07 46.48,16.51 J5.12
  Bottom 0.254: v26.92,38.1 26.92,35.31 29.72,32.51 29.72,23.11 32.26,20.57 33.78,20.57 v34.8,19.56
RS
  Top 0.254: MCP2551.8 20.83,12.19 20.83,10.16 19.56,8.89 R6.2
RX
  Top 0.254: MCP2510.12 57.91,7.87 52.58,7.87 51.56,8.89 48.26,8.89 46.99,10.16 45.97,10.16 43.9,12.23 36.03,12.23 29.72,18.54 26.16,18.54 25.38,19.32 25.38,20.81 27.23,22.66 32.61,22.66 41.4,31.45 41.4,32.26 42.42,33.27 43.18,33.27 44.45,34.54 44.45,35.81 45.21,36.58 46.48,36.58 J5.4
RX1
  Top 0.254: U1.13 50.29,46.23 56.39,46.23 57.66,47.5 58.42,47.5 64.52,53.59 70.36,53.59 73.66,56.9 S01.4
RX2
  Top 0.254: U1.12 50.29,48.77 55.3,48.77 56.57,50.04 58.42,50.04 58.98,50.6 58.98,56.51 65.22,62.74 69.17,62.74 71.2,60.71 76.02,60.71 90.17,46.56 90.17,40.64 89.66,40.13 S02.4
RX3
  Top 0.254: U1.11 50.29,51.31 51.31,51.31 55.88,55.88 57.24,55.88 65,63.65 69.55,63.65 71.94,61.25 76.29,61.25 91.95,45.59 91.95,39.37 96.77,34.54 96.77,20.57 94.74,18.54 S03.4
RX6  (via drill 0.51)
  Top 0.254: U1.18 48.05,35.56 v45.47,35.56 | v45.47,40.64 37.85,40.64 35.56,38.35 31.24,38.35 v26.92,34.04
  Bottom 0.254: v45.47,35.56 44.96,36.07 44.96,40.13 v45.47,40.64 | v26.92,34.04 26.92,24.38 24.13,21.59 14.73,21.59 9.91,16.76 9.91,4.32 10.16,4.06 S06.4
RX9  (via drill 0.51)
  Top 0.254: v52.07,27.18 48.23,27.18 47.53,27.88 41.2,27.88 36.44,23.11 34.53,23.11 32.5,21.08 27.09,21.08 26.42,20.41 v26.42,19.56 | v22.1,10.16 22.1,9.65 20.07,7.62 13.04,7.62 9.62,11.04 9.62,14.03 8.15,15.49 4.06,15.49 3.3,16.26 3.3,19.81 5.33,21.84 S09.4
  Bottom 0.254: v52.07,27.18 52.07,34.04 51.56,34.54 51.56,34.8 50.55,35.81 50.29,35.81 U1.17 | v26.42,19.56 24.13,17.27 24.13,12.19 v22.1,10.16
RX10
  Top 0.254: U1.16 50.04,38.35 47.24,38.35 46.99,38.1 45.47,38.1 42.93,35.56 40.39,35.56 38.1,33.27 27.43,33.27 27.18,33.02 25.15,33.02 24.64,33.53 23.88,33.53 21.34,36.07 21.34,37.85 16.51,42.67 12.19,42.67 S10.4
RX11
  Top 0.254: U1.15 50.04,41.15 50.04,42.16 47.75,44.45 47.75,45.47 44.7,48.51 37.85,48.51 35.31,51.05 34.04,51.05 29.46,55.63 29.46,58.67 S11.4
RX12
  Bottom 0.254: U1.14 50.29,43.69 50.55,43.69 54.1,47.24 54.1,59.94 51.56,62.48 51.56,63.75 S12.4
S_DEC_1  (via drill 0.51)
  Top 0.254: v83.06,19.05 82.3,19.05 80.01,16.76 77.47,16.76 76.2,15.49 62.48,15.49 62.23,15.24 60.45,15.24 59.18,16.51 56.64,16.51 51.56,21.59 46.74,21.59 J5.10
  Bottom 0.254: v83.06,19.05 86.36,15.75 U8.2
S_DEC_2
  Top 0.254: U8.3 86.36,18.03 83.06,18.03 79.25,14.22 77.47,14.22 76.2,12.95 62.48,12.95 62.23,12.7 60.45,12.7 59.18,13.97 56.64,13.97 51.56,19.05 46.74,19.05 J5.11
SCK  (via drill 0.51)
  Top 0.254: v68.33,29.46 68.33,31.75 62.99,37.08 62.99,42.93 61.72,44.2 J6.1
  Bottom 0.254: v68.33,29.46 67.06,28.19 67.06,27.94 65.79,26.67 65.79,12.95 62.99,10.16 62.74,10.41 62.48,10.16 58.17,10.16 MCP2510.13
V_ADJ  (via drill 0.51)
  Top 0.254: v14.22,26.42 14.22,24.64 13.46,23.88 12.95,23.88 LP38693MP-ADJ.2 | R18.2 12.45,29.46 9.14,29.46 5.59,33.02 TP3.TP 5.59,33.27 5.59,38.92 8.38,41.71 8.38,45.21 25.4,62.23 28.7,62.23 32.77,66.29 46.48,66.29 47.76,65.02 47.76,57.4 48.77,56.39 R21.2 49.02,56.39 51.82,56.39 R20.1
  Bottom 0.254: v14.22,26.42 14.22,26.92 12.7,28.45 12.7,29.21 R18.2 | C14.1 65.79,3.05 65.79,3.56 63.5,5.84 63.5,6.35 62.23,7.62 61.21,7.62 59.94,8.89 59.69,8.64 59.44,8.64 59.18,8.89 56.9,8.89 56.64,8.64 56.39,8.64 53.59,11.43 53.59,22.86 50.04,26.42 49.53,26.42 48.51,27.43 48.51,55.12 48.77,55.37 48.77,56.13 R21.2
V_EN  (via drill 0.51)
  Top 0.254: v11.94,17.53 10.61,18.86 10.61,23.34 12.47,25.21 12.78,25.21 LP38693MP-ADJ.1 | v34.29,1.52 49.02,1.52 49.28,1.27 53.34,1.27 v54.36,2.29
  Bottom 0.254: v11.94,17.53 11.94,16.26 13.46,14.73 14.48,14.73 17.53,11.68 17.53,8.13 22.1,3.56 22.1,2.29 23.88,0.51 27.43,0.51 28.45,1.52 v34.29,1.52 | v54.36,2.29 55.88,3.81 56.13,3.81 56.39,3.56 56.64,3.56 56.9,3.81 59.18,3.81 59.44,3.56 59.69,3.56 59.94,3.81 61.47,3.81 J6.17
V_LDO  (via drill 0.51)
  Top 0.254: C13.1 64.77,6.35 65.79,7.37 67.82,7.37 68.83,6.35 71.12,6.35 C10.1 71.37,6.35 72.14,6.35 75.18,9.4 89.15,9.4 | R20.2 61.21,56.39 65.02,56.39 68.07,59.44 69.34,59.44 S01.6 69.6,59.69 69.9,59.99 76.01,59.99 87.61,48.38 87.61,45.84 87.12,45.35 87.12,44.45 S02.6 | 89.15,9.4 95.5,9.4 97.79,11.68 v97.79,21.59 | S12.6 46.23,64.01 44.62,65.61 33.12,65.61 26.69,59.18 25.91,59.18 24.89,58.17 24.89,56.39 S11.6 24.64,56.13 24.64,51.82 23.62,50.8 R22.2 23.37,50.8 16,50.8 15.75,51.05 14.99,51.05 8.89,44.96 8.89,39.12 9.4,38.61 S10.6 9.65,38.35 14.73,38.35 15.75,37.34 TP1.TP 16,37.08 18.54,34.54 18.54,27.43 16.51,25.4 | 16.51,25.4 13.46,22.35 12.95,22.35 LP38693MP-ADJ.3 | 8.62,19.55 9.89,20.82 9.89,24.12 13.18,27.41 14.5,27.41 16.51,25.4 | 8.62,19.55 6.1,17.02 5.59,17.02 S09.6 | 20.32,6.33 23.66,9.68 23.66,12.6 22.75,13.51 14.66,13.51 8.62,19.55 | S06.6 15.49,4.06 15.49,4.32 17.54,6.37 20.32,6.37 20.32,6.33 | 89.15,9.4 89.15,4.06 85.72,0.63 23.75,0.63 20.32,4.06 20.32,6.33
  Bottom 0.254: S02.6 86.87,44.45 85.09,42.67 85.09,39.37 88.39,36.07 88.39,28.45 93.22,23.62 94.49,23.62 S03.6 94.74,23.37 96.01,23.37 v97.79,21.59 | U9.14 23.7,24.49 15.75,32.45 15.75,37.08 TP1.TP
V_TOGGLE  (via drill 0.51)
  Top 0.254: 21.84,30.73 21.84,32.77 R19.2 | 21.84,30.73 21.84,29.46 R18.1 | J5.9 46.74,24.13 47.5,24.13 48.01,24.64 59.44,24.64 61.21,22.86 62.23,22.86 65.53,26.16 65.53,28.45 R17.1 | 21.84,30.73 37.85,30.73 v38.61,29.97
  Bottom 0.254: v38.61,29.97 41.91,26.67 42.16,26.92 43.18,26.92 45.97,24.13 46.48,24.13 J5.9
VIN  (via drill 0.51)
  Top 0.254: C19.2 | C18.1 | 31.75,4.06 J2.4 | 22.86,18.54 25.4,18.54 26.42,17.53 28.45,17.53 MCP2551.3 | 22.86,18.54 19.81,18.54 19.05,17.78 19.05,16.76 17.53,15.24 13.97,15.24 12.95,16.26 12.95,20.57 LP38693MP-ADJ.4 | 22.86,18.54 22.86,21.68 21.57,22.97 21.57,26.51 19.92,28.16 19.92,35.71 TP2.TP
  Top 0.457: 43,25.33 53.34,25.33
  Top 0.508: v55.12,27.18 55.12,27.1 53.34,25.33 | 43,25.33 42.46,25.87 40.61,25.87 36.73,21.99 C12.1 | C19.2 C18.1 | C19.2 23.95,5.65 25.08,6.78 29.03,6.78 31.75,4.06
  Bottom 0.254: 36.32,21.84 C12.1 | 37.08,18.8 R2.1 | 61.47,39.12 J6.3 | 24.13,4.83 C19.2 | 28.45,17.27 MCP2551.3 28.7,17.27
  Bottom 0.508: 36.32,21.84 37.34,20.83 37.34,19.81 37.08,19.56 37.08,18.8 | 61.47,39.12 59.51,37.16 56.21,37.16 55.12,36.07 v55.12,27.18 | 24.13,4.83 25.91,6.6 25.91,15.75 27.43,17.27 28.45,17.27 | 28.7,17.27 29.72,17.27 30.73,16.26 34.54,16.26 36.83,18.54 R2.1

### Text on the board
tPlace: Status- / Debug | OR1 | V_ADJ | OR2 | OR3 | V_LDO | VIN | LDO1 | Sonar PWR | BW / PW / AN / RX / TX / 5V / GND
bPlace: #4-40 Screw / (0.13" Hole) | Sonar Sonsor Shield V2 / for Arduino Micro